# Altium schematic sheet LINK2_LPC4322-USB-BRPWR.SchDoc
size A3; CheckedBy: José Ogando; Engineer: Eduardo Teofilo; Revision: A2; SheetNumber: 7; SheetTotal: 8
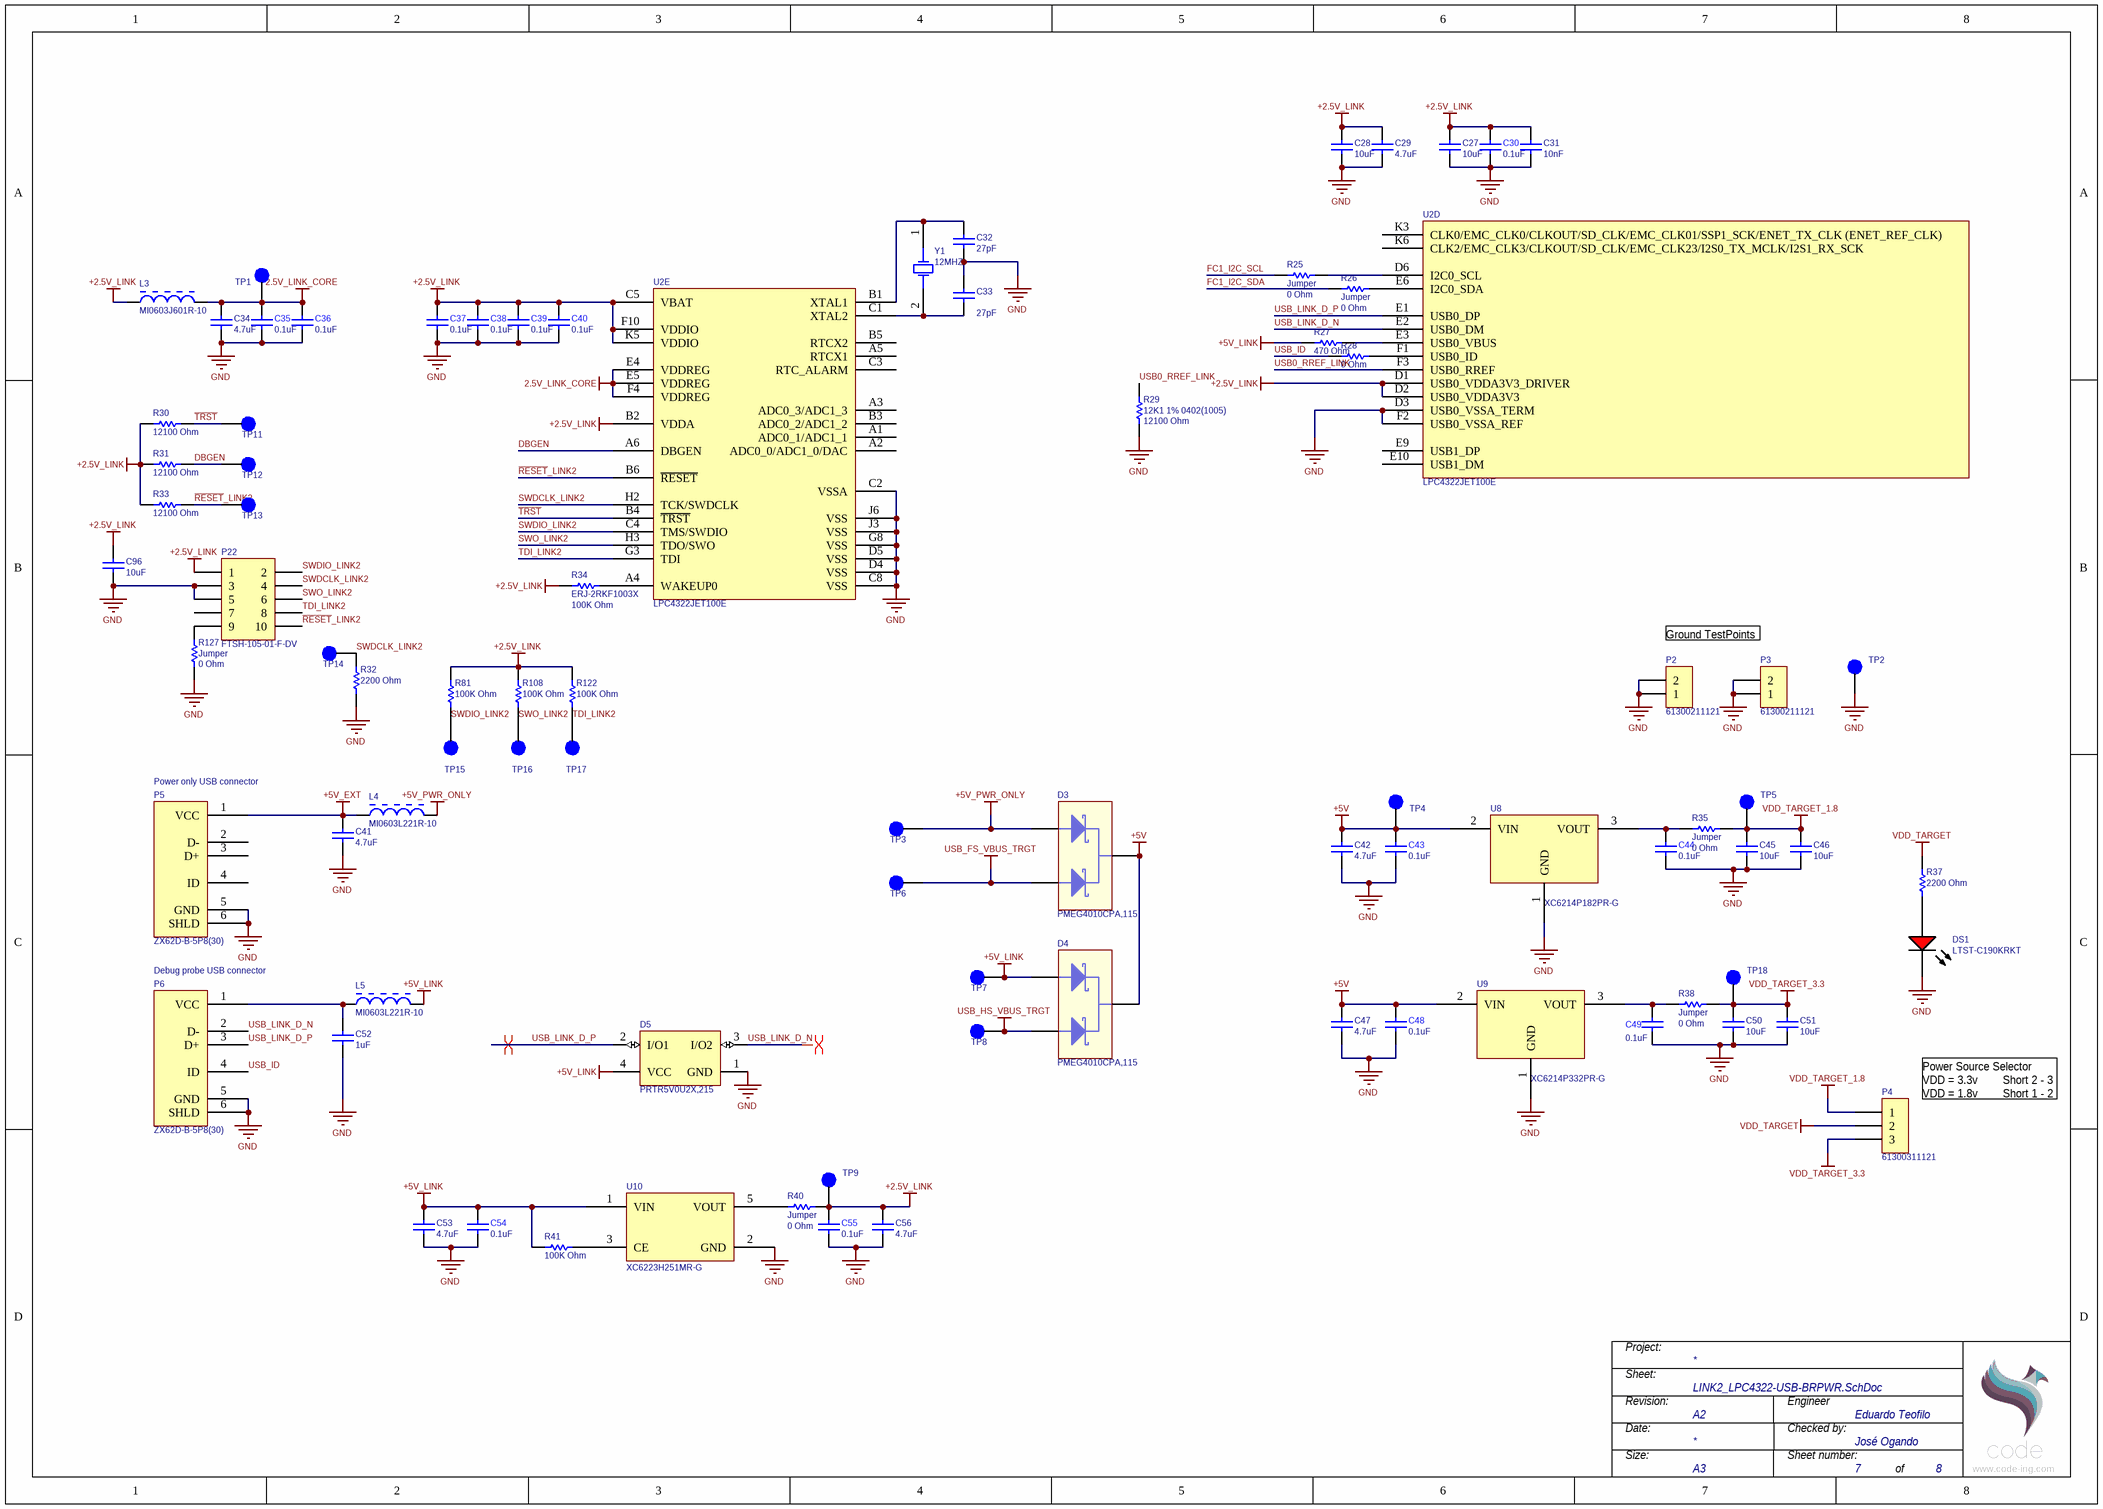
[diagram p0: LINK2_LPC4322-USB-BRPWR.SchDoc]

## Parts
C27  value 10uF  [CAPC0805(2012)145_L]  (hidden comment: CAP 10uF 10V 0805(2012))
C28  value 10uF  [CAPC0805(2012)145_L]  (hidden comment: CAP 10uF 10V 0805(2012))
C29  value 4.7uF  [CAPC0603(1608)100_L]  (hidden comment: CAP 4.7uF 10V 0603(1608))
C30  value 0.1uF  [CAPC1005]  (hidden comment: CC0402KRX7R7BB104)
C31  value 10nF  [CAPC0402(1005)60_L]  (hidden comment: CAP 10nF 25V 0402(1005))
C32  value 27pF  [CAPC0402(1005)60_L]  (hidden comment: CAP 27pF 50V 0402(1005))
C33  value 27pF  [CAPC0402(1005)60_L]  (hidden comment: CAP 27pF 50V 0402(1005))
C34  value 4.7uF  [CAPC0603(1608)100_L]  (hidden comment: CAP 4.7uF 10V 0603(1608))
C35  value 0.1uF  [CAPC1005]  (hidden comment: CC0402KRX7R7BB104)
C36  value 0.1uF  [CAPC1005]  (hidden comment: CC0402KRX7R7BB104)
C37  value 0.1uF  [CAPC1005]  (hidden comment: CC0402KRX7R7BB104)
C38  value 0.1uF  [CAPC1005]  (hidden comment: CC0402KRX7R7BB104)
C39  value 0.1uF  [CAPC1005]  (hidden comment: CC0402KRX7R7BB104)
C40  value 0.1uF  [CAPC1005]  (hidden comment: CC0402KRX7R7BB104)
C41  value 4.7uF  [CAPC0603(1608)100_L]  (hidden comment: CAP 4.7uF 10V 0603(1608))
C42  value 4.7uF  [CAPC0603(1608)100_L]  (hidden comment: CAP 4.7uF 10V 0603(1608))
C43  value 0.1uF  [CAPC1005]  (hidden comment: CC0402KRX7R7BB104)
C44  value 0.1uF  [CAPC1005]  (hidden comment: CC0402KRX7R7BB104)
C45  value 10uF  [CAPC0805(2012)145_L]  (hidden comment: CAP 10uF 10V 0805(2012))
C46  value 10uF  [CAPC0805(2012)145_L]  (hidden comment: CAP 10uF 10V 0805(2012))
C47  value 4.7uF  [CAPC0603(1608)100_L]  (hidden comment: CAP 4.7uF 10V 0603(1608))
C48  value 0.1uF  [CAPC1005]  (hidden comment: CC0402KRX7R7BB104)
C49  value 0.1uF  [CAPC1005]  (hidden comment: CC0402KRX7R7BB104)
C50  value 10uF  [CAPC0805(2012)145_L]  (hidden comment: CAP 10uF 10V 0805(2012))
C51  value 10uF  [CAPC0805(2012)145_L]  (hidden comment: CAP 10uF 10V 0805(2012))
C52  value 1uF  [CAPC0402(1005)60_L]  (hidden comment: CAP 1uF 10V 0402(1005))
C53  value 4.7uF  [CAPC0603(1608)100_L]  (hidden comment: CAP 4.7uF 10V 0603(1608))
C54  value 0.1uF  [CAPC1005]  (hidden comment: CC0402KRX7R7BB104)
C55  value 0.1uF  [CAPC1005]  (hidden comment: CC0402KRX7R7BB104)
C56  value 4.7uF  [CAPC0603(1608)100_L]  (hidden comment: CAP 4.7uF 10V 0603(1608))
C96  value 10uF  [CAPC0805(2012)145_L]  (hidden comment: CAP 10uF 10V 0805(2012))
D3  PMEG4010CPA,115  [SOT1061]
D4  PMEG4010CPA,115  [SOT1061]
D5  PRTR5V0U2X,215  [NXP-SOT143B-4_V]
DS1  LTST-C190KRKT  [LTST-C191KRKT_V]
L3  MI0603J601R-10  [LIRD-MI0603J601R-10_V]
L4  MI0603L221R-10  [LIRD-HZ0603C601R-10-2_V]
L5  MI0603L221R-10  [LIRD-HZ0603C601R-10-2_V]
P2  61300211121  [61300211121]
P3  61300211121  [61300211121]
P4  61300311121  [61300311121]
P5  ZX62D-B-5P8(30)  [ZX62D-B-5P8(30)]
P6  ZX62D-B-5P8(30)  [ZX62D-B-5P8(30)]
P22  FTSH-105-01-F-DV  [FTSH-105-01-L-DV-K]
R25  Jumper  value 0 Ohm  [RESC0402(1005)_L]
R26  Jumper  value 0 Ohm  [RESC0402(1005)_L]
R27  value 470 Ohm  [RESC0402(1005)_L]  (hidden comment: 470R 5% 0402(1005))
R28  value 0 Ohm  [RESC0402(1005)_L]  (hidden comment: Jumper 0402(1005))
R29  12K1 1% 0402(1005)  value 12100 Ohm  [RESC0402(1005)_L]
R30  value 12100 Ohm  [RESC0402(1005)_L]  (hidden comment: 12K1 1% 0402(1005))
R31  value 12100 Ohm  [RESC0402(1005)_L]  (hidden comment: 12K1 1% 0402(1005))
R32  value 2200 Ohm  [RESC0402(1005)_L]  (hidden comment: 2K2 1% 0402(1005))
R33  value 12100 Ohm  [RESC0402(1005)_L]  (hidden comment: 12K1 1% 0402(1005))
R34  ERJ-2RKF1003X  value 100K Ohm  [RESC1005X40X25LL05T05]
R35  Jumper  value 0 Ohm  [RESC0402(1005)_L]
R37  value 2200 Ohm  [RESC0402(1005)_L]  (hidden comment: 2K2 1% 0402(1005))
R38  Jumper  value 0 Ohm  [RESC0402(1005)_L]
R40  Jumper  value 0 Ohm  [RESC0402(1005)_L]
R41  value 100K Ohm  [RESC1005X40X25LL05T05]  (hidden comment: ERJ-2RKF1003X)
R81  value 100K Ohm  [RESC1005X40X25LL05T05]  (hidden comment: ERJ-2RKF1003X)
R108  value 100K Ohm  [RESC1005X40X25LL05T05]  (hidden comment: ERJ-2RKF1003X)
R122  value 100K Ohm  [RESC1005X40X25LL05T05]  (hidden comment: ERJ-2RKF1003X)
R127  Jumper  value 0 Ohm  [RESC0402(1005)_L]
TP1  TP 1mm  [SMT Test Point]  (value not drawn)  (no BOM)
TP2  TP 1mm  [SMT Test Point]  (value not drawn)  (no BOM)
TP3  TP 1mm  [SMT Test Point]  (value not drawn)  (no BOM)
TP4  TP 1mm  [SMT Test Point]  (value not drawn)  (no BOM)
TP5  TP 1mm  [SMT Test Point]  (value not drawn)  (no BOM)
TP6  TP 1mm  [SMT Test Point]  (value not drawn)  (no BOM)
TP7  TP 1mm  [SMT Test Point]  (value not drawn)  (no BOM)
TP8  TP 1mm  [SMT Test Point]  (value not drawn)  (no BOM)
TP9  TP 1mm  [SMT Test Point]  (value not drawn)  (no BOM)
TP11  TPAD 0.8mm  [TH Test Pad 0.8mm]  (value not drawn)  (no BOM)
TP12  TPAD 0.8mm  [TH Test Pad 0.8mm]  (value not drawn)  (no BOM)
TP13  TPAD 0.8mm  [TH Test Pad 0.8mm]  (value not drawn)  (no BOM)
TP14  TPAD 0.8mm  [TH Test Pad 0.8mm]  (value not drawn)  (no BOM)
TP15  TPAD 0.8mm  [TH Test Pad 0.8mm]  (value not drawn)  (no BOM)
TP16  TPAD 0.8mm  [TH Test Pad 0.8mm]  (value not drawn)  (no BOM)
TP17  TPAD 0.8mm  [TH Test Pad 0.8mm]  (value not drawn)  (no BOM)
TP18  TP 1mm  [SMT Test Point]  (value not drawn)  (no BOM)
U2  LPC4322JET100E  [BGA100_9x9x1.2mm]  (parts D,E of 5)
U8  XC6214P182PR-G  [SOT-89-3]
U9  XC6214P332PR-G  [SOT-89-3]
U10  XC6223H251MR-G  [SOT25]
Y1  value 12MHZ  [2-LEAD 11.4X4.8]  (hidden comment: ABLS2-12.000MHZ-D4Y-T)

## Nets
2.5V_LINK_CORE: C34.2 C35.1 C36.1 L3.2 TP1.1(TP) U2.E4(VDDREG) U2.E5(VDDREG) U2.F4(VDDREG)
+2.5V_LINK: C27.2 C28.2 C29.2 C30.1 C31.2 C37.1 C38.1 C39.1 C40.1 C55.1 C56.2 C96.2 L3.1 P22.1 R30.2 R31.1 R33.2 R34.1 R40.1 R81.2 R108.2 R122.2 TP9.1(TP) U2.B2(VDDA) U2.C5(VBAT) U2.D1(USB0_VDDA3V3_DRIVER) U2.D2(USB0_VDDA3V3) U2.F10(VDDIO) U2.K5(VDDIO)
+5V: C42.2 C43.1 C47.2 C48.1 D3.3(K) D4.3(K) TP4.1(TP) U8.2(VIN) U9.2(VIN)
+5V_EXT: C41.2 L4.1 P5.1(VCC)
+5V_LINK: C53.2 C54.1 D4.1(A1) D5.4(VCC) L5.2 R27.2 R41.1 TP7.1(TP) U10.1(VIN)
+5V_PWR_ONLY: D3.1(A1) L4.2 TP3.1(TP)
GND: C27.1 C28.1 C29.1 C30.2 C31.1 C32.1 C33.2 C34.1 C35.2 C36.2 C37.2 C38.2 C39.2 C40.2 C41.1 C42.1 C43.2 C44.2 C45.1 C46.1 C47.1 C48.2 C49.2 C50.1 C51.1 C52.1 C53.1 C54.2 C55.2 C56.1 C96.1 D5.1(GND) DS1.2(K) P2.1 P2.2 P3.1 P3.2 P5.5(GND) P5.6(SHLD) P6.5(GND) P6.6(SHLD) P22.3 P22.5 R29.2 R32.1 R127.1 TP2.1(TP) U2.C2(VSSA) U2.C8(VSS) U2.D3(USB0_VSSA_TERM) U2.D4(VSS) U2.D5(VSS) U2.F2(USB0_VSSA_REF) U2.G8(VSS) U2.J3(VSS) U2.J6(VSS) U8.1(GND) U9.1(GND) U10.2(GND)
USB_FS_VBUS_TRGT: D3.2(A2) TP6.1(TP)
USB_HS_VBUS_TRGT: D4.2(A2) TP8.1(TP)
VDD_TARGET: P4.2 R37.2
VDD_TARGET_1.8: C45.2 C46.2 P4.1 R35.1 TP5.1(TP)
VDD_TARGET_3.3: C50.2 C51.2 P4.3 R38.1 TP18.1(TP)
DBGEN: R31.2 TP12.1(TP) U2.A6(DBGEN)
FC1_I2C_SCL: R25.2
FC1_I2C_SDA: R26.2
~{RESET}_LINK2: P22.10 R33.1 TP13.1(TP) U2.B6(~{RESET})
SWDCLK_LINK2: P22.4 R32.2 TP14.1(TP) U2.H2(TCK/SWDCLK)
SWDIO_LINK2: P22.2 R81.1 TP15.1(TP) U2.C4(TMS/SWDIO)
SWO_LINK2: P22.6 R108.1 TP16.1(TP) U2.H3(TDO/SWO)
~{TRST}: R30.1 TP11.1(TP) U2.B4(~{TRST})
TDI_LINK2: P22.8 R122.1 TP17.1(TP) U2.G3(TDI)
USB0_RREF_LINK: R29.1 U2.F3(USB0_RREF)
USB_ID: P6.4(ID) R28.1
USB_LINK_D_N: D5.3(I/O2) P6.2(D-) U2.E2(USB0_DM)
USB_LINK_D_P: D5.2(I/O1) P6.3(D+) U2.E1(USB0_DP)
NetC32_2: C32.2 U2.B1(XTAL1) Y1.1(OSC1)
NetC33_1: C33.1 U2.C1(XTAL2) Y1.2
NetC44_1: C44.1 R35.2 U8.3(VOUT)
NetC49_1: C49.1 R38.2 U9.3(VOUT)
NetC52_2: C52.2 L5.1 P6.1(VCC)
NetDS1_1: DS1.1(A) R37.1
NetP22_9: P22.9 R127.2
NetR25_1: R25.1 U2.D6(I2C0_SCL)
NetR26_1: R26.1 U2.E6(I2C0_SDA)
NetR27_1: R27.1 U2.E3(USB0_VBUS)
NetR28_2: R28.2 U2.F1(USB0_ID)
NetR34_2: R34.2 U2.A4(WAKEUP0)
NetR40_2: R40.2 U10.5(VOUT)
NetR41_2: R41.2 U10.3(CE)

Not connected (* = marked no-connect by the designer): P5 2(D-) 3(D+) 4(ID); P22 7; U2 A1(ADC0_1/ADC1_1) A2(ADC0_0/ADC1_0/DAC) A3(ADC0_3/ADC1_3) A5(RTCX1) B3(ADC0_2/ADC1_2) B5(RTCX2) C3(RTC_ALARM) E9(USB1_DP) E10(USB1_DM) K3(CLK0/EMC_CLK0/CLKOUT/SD_CLK/EMC_CLK01/SSP1_SCK/ENET_TX_CLK_(ENET_REF_CLK)) K6(CLK2/EMC_CLK3/CLKOUT/SD_CLK/EMC_CLK23/I2S0_TX_MCLK/I2S1_RX_SCK); U10 4(NC)

## Layout directives
differential pair: USB_LINK_D_N, USB_LINK_D_P

## Notes on the sheet
- Ground TestPoints
- (near P5) Power only USB connector
- Debug probe USB connector
- (near P4) Power Source Selector
  VDD = 3.3v        Short 2 - 3
  VDD = 1.8v        Short 1 - 2
- Project:
- Sheet:
- Revision:
- Date:
- Size:
- Sheet number:
- Engineer
- Checked by:
- A3
- of
- www.code-ing.com

## Library data of the parts
C27 C28 C45 C46 C50 C51 C96 = CMP-1036-04922-1: CAP 10uF 10V ±10% 0805 (2012 Metric) Thickness 1.45mm SMD; Tolerance: Â±10%; Case-EIA: 0805; Case-Metric: 2012; Technology: SMT; Rated Voltage: 10 V; Max Thickness: 1.45 mm
C29 C34 C41 C42 C47 C53 C56 = CMP-1035-02785-1: CAP 4.7uF 10V ±10% 0603 (1608 Metric) Thickness 1mm SMD; Tolerance: Â±10%; Case-EIA: 0603; Case-Metric: 1608; Max Thickness: 1 mm; Technology: SMT; Rated Voltage: 10 V
C30 C35-C40 C43 C44 C48 C49 C54 C55 = CMP-0001-00074-1: Capacitor, Yageo, Ceramic, 0.1uF 10% 16V 0402 (1005) X7R; Polarity: Non-Polarized; ClassName: Board Template Device; Rated Voltage: 16 V; Status: Production; Tolerance: 10 %; Mounting Technology: Surface Mount; Technology: Ceramic; Category: Capacitor; Dielectric: X7R; Publisher: Altium
C31 = CMP-1034-01880-1: CAP 10nF 25V ±10% 0402 (1005 Metric) Thickness 0.6mm SMD; Tolerance: Â±10%; Case-Metric: 1005; Case-EIA: 0402; Technology: SMT; Max Thickness: 0.6 mm; Rated Voltage: 25 V
C32 C33 = CMP-1034-00963-1: CAP 27pF 50V ±5% 0402 (1005 Metric) Thickness 0.6mm SMD; Case-EIA: 0402; Case-Metric: 1005; Tolerance: Â±5%; Max Thickness: 0.6 mm; Rated Voltage: 50 V; Technology: SMT
C52 = CMP-1034-02118-1: CAP 1uF 10V -20% to +80% 0402 (1005 Metric) Thickness 0.6mm SMD; Case-EIA: 0402; Case-Metric: 1005; Tolerance: -20% to +80%; Max Thickness: 0.6 mm; Rated Voltage: 10 V; Technology: SMT
D3 D4 = PMEG4010CPA,115: DIODE ARRAY SCHOTTKY 40V 3HUSON; Manufacturer: Nexperia USA Inc.; Manufacturer part #: PMEG4010CPA,115; Created by: eteoflo; Creation date: 10-Apr-2018; Indications: *; Modified by: *; Value: *
D5 = CMP-2000-05285-1: Ultra Low Capacitance Double Rail-to-Rail ESD Protection Diode, 5.5 V, 1 pF, -40 to 85 degC, 4-Pin SOT143B, RoHS, Tape and Reel; Manufacturer: NXP Semiconductors; Capacitance Value: 16pF; Number of Elements: 1; Rad Hardened: No; Reverse Breakdown Voltage: 6V; Working Voltage (Max): 5.5V; Polarity: Uni-Directional; Configuration: Quad; Leakage Current: 0.1uA; Product Height (mm): 1mm; Suppressor Type: DiodeArrays; Product Length (mm): 3mm; Product Depth (mm): 1.4mm; ESD Protection Voltage: 8KV@ContactDisc; Package Type: SOT; Mounting: SurfaceMount; Packaging: TapeandReel; Datasheet Version: Rev. 02, 01/2008; Reverse Stand-off Voltage: 5.5V; Manufacturer URL: http://www.nxp.com/; Operating Temp Range: -40Cto85C; Operating Temperature Classification: Industrial; Working Voltage: 5.5V; Operating Temperature Min Deg. C: -40C; Datasheet URL: https://datasheet.ciiva.com/4479/prtr5v0u2x-102853-4479461.pdf; Leakage Current (Max): 0.1uA; Direction Type: Uni-Directional; Pin Count: 3+Tab; Operating Temperature Max Deg. C: 85C; Mounting Style: SurfaceMount; Package / Case: SOT
DS1 = CMP-1674-00011-1: LED Uni-Color Red, 62.5 mW, 5 V, -30 to 85 degC, 2-Pin SMD, RoHS, Tape and Reel; Capacitance: 100 uF; Voltage Rating: 50 V; Case\Package: Radial; Tolerance: 20%; Packaging: Bulk; REACH SVHC: No SVHC; ComponentLink1Description: Manufacturer URL; ComponentLink2URL: http://optoelectronics.liteon.com/upload/download/DS-22-99-0151/S_110_LTST-C190KRKT.pdf; Max Operating Temperature: 85 degC; DatasheetVersion: Rev. F, 05/2013; Pins: 2; Voltage Rating (DC): 50 V; Mount: Through Hole; Lead Pitch: 3.5 mm; Diameter: 8 mm; ComponentLink1URL: http://www.us.liteon.com/; Radiation Hardening: No; Package Quantity: 200; PackageReference: C191KRKT; RoHSCompliant: true; Height: 11.5 mm; PackageDescription: 2-Pin Surface Mount Device, Body 1.6 x 0.8 mm; Length: 11.5 mm; ComponentLink2Description: Datasheet; Min Operating Temperature: -40 degC
L3 = CMP-2000-06700-1: Ferrite Bead, 600 Ohm, 1 A, -40 to 125 degC, 2-Pin SMD, RoHS, Tape and Reel; Manufacturer: Laird; DC Resistance (DCR) (Max): 200mOhm; Online Catalog: MISeries; Number of Lines: 1; Kits: 240-2227-ND-KITEMIFERRITEBEADCHIPSMD; Other Names: 240-2371-1; Impedance @ Frequency: 600Ohm@100MHz; Filter Type: PowerLine; Current Rating (Max): 1A; Catalog Drawings: (HI,HZ,LI,MI)0603Series_0.95mmMax.Height; Datasheet Version: Rev. C, 08/2013; Ratings: -; Package Description: 2-Pin Surface Mount Device, Body 1.6 x 0.8 mm; Operating Temperature: -40°C~125°C; Category: Filters; Mounting Type: SurfaceMount; Size / Dimension: 0.063"Lx0.031"W(1.60mmx0.80mm); Family: FerriteBeadsandChips; Package Reference: MI00603J601R-10; Manufacturer URL: https://www.lairdtech.com/; Height (Max): 0.037"(0.95mm); Series: MI; Packaging: CutTape(CT); Mounting Technology: SurfaceMount; Package / Case: 0603(1608Metric); Standard Package: 1; Datasheet URL: http://cdn.lairdtech.com/home/brandworld/files/MI0603J601R-10.pdf
L4 L5 = CMP-2000-06701-1: Chip Bead, 100 MHz, 2 A, -40 to 125 degC, 2-Pin SMD (0603), RoHS, Tape and Reel; Case Height: 0.5mm; Impedance: 220Ohms; Maximum DC Resistance: 80mOhms; Brand: LairdTechnologies; Case Length: 1.6mm; Maximum DC Current: 2A; Unit Weight: 0.000192oz; Test Frequency: 100MHz; Package Description: 2-Pin Surface Mount Device, Body 1.6 x 0.8 mm; Datasheet URL: http://cdn.lairdtech.com/home/brandworld/files/MI0603L221R-10.pdf; Package Reference: 0603; Factory Pack Quantity: 4000; Mounting Technology: SurfaceMount; Packaging: Reel; Case Width: 0.5mm; Operating Temperature Range: -40Cto+125C; Dimensions: 0.5mmWx1.6mmLx0.5mmH; Package / Case: 0603(1608metric); Product Category: EMIFilterBeads,Chips&Arrays; Series: MI; Manufacturer URL: https://www.lairdtech.com/; Termination Style: SMD/SMT; Manufacturer: LairdTechnologies; Product: FerriteChipBeads; Datasheet Version: Rev. E, 08/2013; RoHS: Details
P2 P3 = 61300211121: HEADER 2POS SNGL T/H 2.54MM; Manufacturer: Wurth Electronics Inc; Indications: DNI; Manufacturer part #: 61300211121; Modified by: *; Value: *; Created by: gmoreno; Creation date: 28-Jul-2012
P4 = 61300311121: HEADER 3POS SNGL T/H 2.54MM; Manufacturer: Wurth Electronics Inc; Manufacturer part #: 61300311121; DigiKey: *; Indications: *; Modified by: *; Value: *; Created by: gmoreno; Creation date: 28-Jul-2012
P5 P6 = ZX62D-B-5P8(30): CONN RCPT USB MICRO B SMD; Manufacturer: Hirose Electric Co Ltd; Manufacturer part #: ZX62D-B-5P8(30); Created by: eteofilo; Creation date: 09-Apr-2018; Modified by: *; Value: *; Indications: *
P22 = FTSH-105-01-F-DV: CONN HEADER 10POS DUAL .05" SMD; Manufacturer: Samtec Inc; Indications: DNI; Manufacturer part #: FTSH-105-01-F-DV; Created by: gmoreno; Creation date: 29-Jul-2013; Value: *; Modified by: *
R25 R26 R28 R35 R38 R40 R127 = CMP-1011-00001-1: Jumper 0402 (1005 Metric); Tolerance: None; Case-Metric: 1005; Case-EIA: 0402; Power: None; Technology: SMT
R27 = CMP-1011-00066-1: 470R 0.063W 5% 0402 (1005 Metric)  SMD; Case-EIA: 0402; Case-Metric: 1005; Technology: SMT; Tolerance: 5 %; Power: 0.063 W
R29-R31 R33 = CMP-1011-00632-1: 12K1 0.063W 1% 0402 (1005 Metric)  SMD; Case-EIA: 0402; Case-Metric: 1005; Power: 0.063 W; Tolerance: 1 %; Technology: SMT
R32 R37 = CMP-1011-00546-1: 2K2 0.063W 1% 0402 (1005 Metric)  SMD; Case-Metric: 1005; Case-EIA: 0402; Power: 0.063 W; Tolerance: 1 %; Technology: SMT
R34 R41 R81 R108 R122 = CMP-2002-00608-3: Chip Resistor, 100 KOhm, +/- 1%, 100 mW, -55 to 155 degC, 0402 (1005 Metric), RoHS, Tape and Reel; Manufacturer: Basic Passives; Power Rating: 100 mW; Voltage Rating: 50 V; Case\/Package: 0402; Case Code (Imperial): 0402; RoHSCompliant: true; Min Operating Temperature: -55 degC; Mount: Surface Mount; Packaging: Tape and Reel; PackageDescription: 2-Pin Surface Mount Device, Body 1 x 0.5 mm; Tolerance: 1%; REACH SVHC: Yes; ComponentLink1URL: http://www.panasonic.com/; ComponentLink1Description: Manufacturer URL; Package Quantity: 10000; Mounting Technology: Surface Mount; DatasheetVersion: 04/2015; PartNumber: ERJ-2RKF1003X; Height: 0.35 mm; Pins: 2; Length: 1 mm; Max Operating Temperature: 155 degC; ComponentLink2Description: Datasheet; ComponentLink2URL: http://industrial.panasonic.com/cdbs/www-data/pdf/RDA0000/AOA0000C86.pdf; PackageReference: 0402; Radiation Hardening: No; Width: 0.5 mm; Case Code (Metric): 1005
TP1-TP9 TP18 = TP 1mm: PCB TEST POINT SMT 1mm; Manufacturer part #: *; DigiKey: *; Indications: *; Value: *; Modified by: *; Manufacturer: *; Created by: gmoreno; Creation date: 26-Apr-2012
TP11-TP17 = TP 0.8mm: PCB TEST PAD TH 0.8mm; Manufacturer part #: *; DigiKey: *; Indications: *; Value: *; Modified by: *; Manufacturer: *; Created by: eteofilo; Creation date: 22-Feb-2018
U2 = LPC4322JET100E: IC MCU 32BIT 512KB FLASH 100BGA; Manufacturer: NXP; Manufacturer Part #: LPC4322JET100E; Created by: eteofilo; Creation Date: 09-Apr-2018; Modified by: *; Indications: *; Value: *
U8 = XC6214P182PR-G: IC REG LDO 1.8V 0.5A SOT89-3; Manufacturer: Torex Semiconductor Ltd; Indications: *; Created by: eteofilo; Creation date: 30-May-2018; Manufacturer part #: XC6214P182PR-G; Modified by: *; Value: *
U9 = XC6214P332PR-G: IC REG LDO 3.3V 0.5A SOT89-3; Manufacturer: Torex Semiconductor Ltd; Indications: *; Created by: eteofilo; Creation date: 30-May-2018; Manufacturer part #: XC6214P332PR-G; Modified by: *; Value: *
U10 = XC6223H251MR-G: IC REG LINEAR 2.5V SOT25-5; Manufacturer: Torex Semiconductor; Manufacturer part #: XC6223H251MR-G; Modified by: *; Indications: *; Value: *; Created by: eteofilo; Creation date: 30-May-2018
Y1 = ABLS2-12.000MHZ-D4Y-T: CRYSTAL 12.0000MHZ 18PF SMD; Manufacturer: Abracon LLC; Manufacturer part #: ABLS2-12.000MHZ-D4Y-T; Indications: *; Modified by: *; Created by: eteofilo; Creation date: 06-Jul-2017